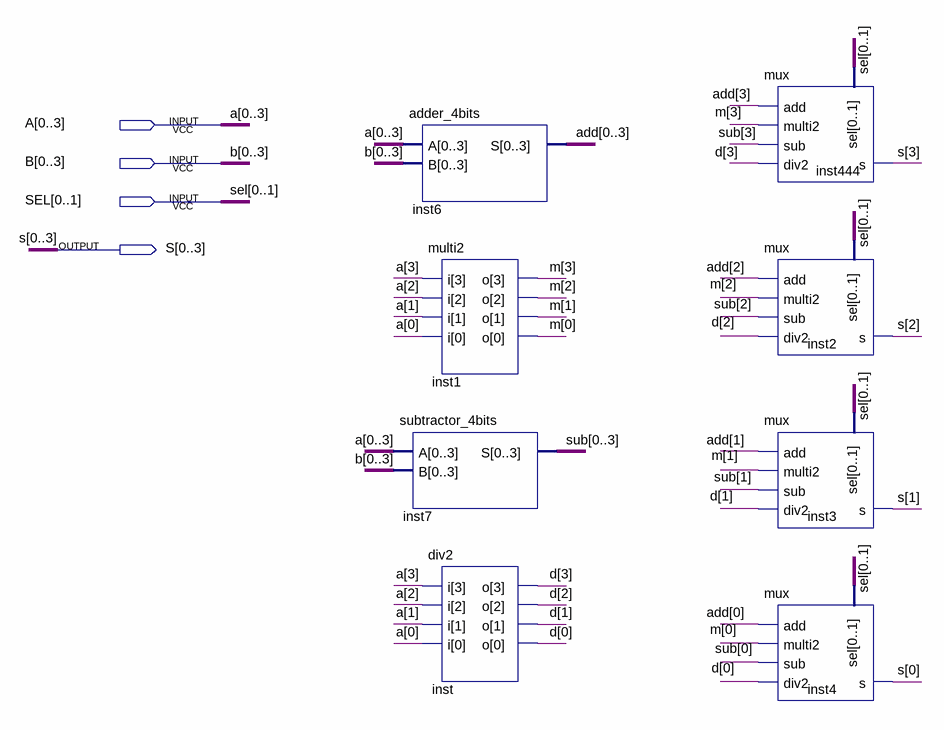
[diagram p0: schematic sheet]
// Quartus schematic ula.bdf as structural Verilog: 8 symbols, 4 pins
module ula (
  input  [0:3] A,
  input  [0:3] B,
  input  [0:1] SEL,
  output [0:3] S
);

  wire [3:0] add, d, m, sub;

  adder_4bits inst6 (.A(A), .B(B), .S({add[0], add[1], add[2], add[3]}));
  multi2 inst1 (.i({A[3], A[2], A[1], A[0]}), .o(m));
  subtractor_4bits inst7 (.A(A), .B(B), .S({sub[0], sub[1], sub[2], sub[3]}));
  div2 inst (.i({A[3], A[2], A[1], A[0]}), .o(d));
  mux inst444 (.sel(SEL), .add(add[3]), .multi2(m[3]), .sub(sub[3]), .div2(d[3]), .s(S[3]));
  mux inst2 (.sel(SEL), .add(add[2]), .multi2(m[2]), .sub(sub[2]), .div2(d[2]), .s(S[2]));
  mux inst3 (.sel(SEL), .add(add[1]), .multi2(m[1]), .sub(sub[1]), .div2(d[1]), .s(S[1]));
  mux inst4 (.sel(SEL), .add(add[0]), .multi2(m[0]), .sub(sub[0]), .div2(d[0]), .s(S[0]));
endmodule
